# EAGLE schematic mosca (EAGLE 8.3.1)
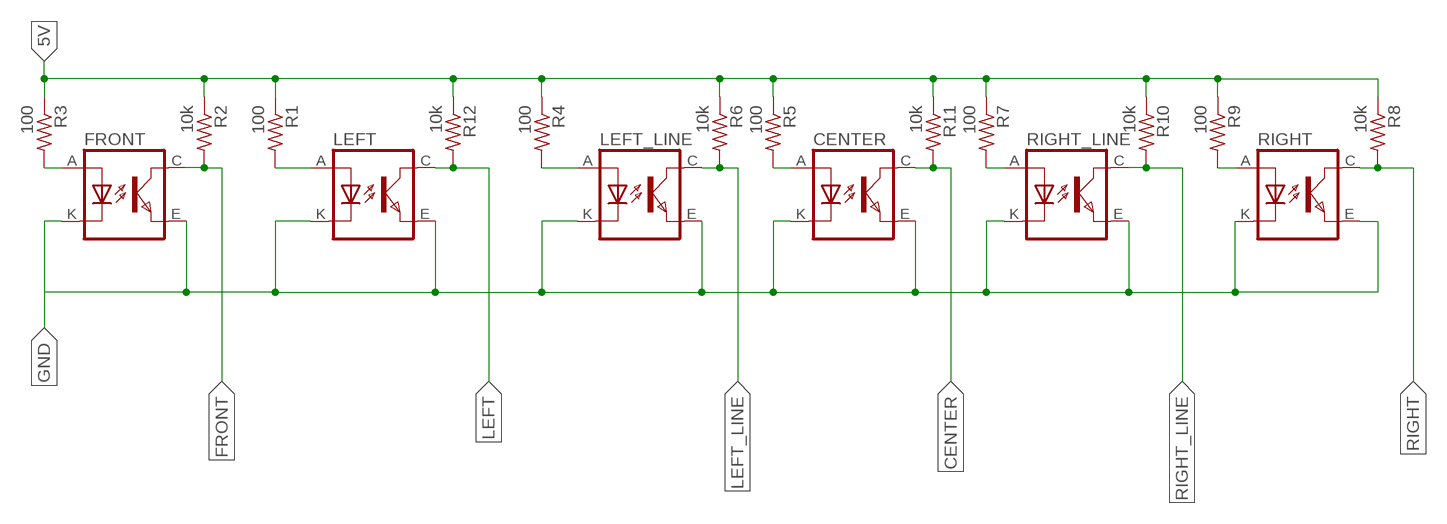
[diagram p0: schematic, sheet 1]

## Parts
CENTER  TCRT5000  [TCRT5000]
FRONT  TCRT5000  [TCRT5000]
LEFT  TCRT5000  [TCRT5000]
LEFT_LINE  TCRT5000  [TCRT5000]
R1  100  R-US_0204/7  [0204/7]
R2  10k  R-US_0204/7  [0204/7]
R3  100  R-US_0204/7  [0204/7]
R4  100  R-US_0204/7  [0204/7]
R5  100  R-US_0204/7  [0204/7]
R6  10k  R-US_0204/7  [0204/7]
R7  100  R-US_0204/7  [0204/7]
R8  10k  R-US_0204/7  [0204/7]
R9  100  R-US_0204/7  [0204/7]
R10  10k  R-US_0204/7  [0204/7]
R11  10k  R-US_0204/7  [0204/7]
R12  10k  R-US_0204/7  [0204/7]
RIGHT  TCRT5000  [TCRT5000]
RIGHT_LINE  TCRT5000  [TCRT5000]

## Nets
5V: R1.1 R2.1 R3.1 R4.1 R5.1 R6.1 R7.1 R8.1 R9.1 R10.1 R11.1 R12.1
CENTER: CENTER.C(COLLECTOR) R11.2
FRONT: FRONT.C(COLLECTOR) R2.2
GND: CENTER.E(EMITTER) CENTER.K(CATHODE) FRONT.E(EMITTER) FRONT.K(CATHODE) LEFT.E(EMITTER) LEFT.K(CATHODE) LEFT_LINE.E(EMITTER) LEFT_LINE.K(CATHODE) RIGHT.E(EMITTER) RIGHT.K(CATHODE) RIGHT_LINE.E(EMITTER) RIGHT_LINE.K(CATHODE)
LEFT: LEFT.C(COLLECTOR) R12.2
LEFT_LINE: LEFT_LINE.C(COLLECTOR) R6.2
N$1: LEFT_LINE.A(ANODE) R4.2
N$2: LEFT.A(ANODE) R1.2
N$3: CENTER.A(ANODE) R5.2
N$4: R7.2 RIGHT_LINE.A(ANODE)
N$5: R9.2 RIGHT.A(ANODE)
N$6: FRONT.A(ANODE) R3.2
RIGHT: R8.2 RIGHT.C(COLLECTOR)
RIGHT_LINE: R10.2 RIGHT_LINE.C(COLLECTOR)

## Library data of the parts
CENTER FRONT LEFT LEFT_LINE RIGHT RIGHT_LINE = tcrt5000:TCRT5000
R1 R11 = rcl:R-US_: RESISTOR, American symbol; 100OHM: 100
R2-R10 R12 = rcl:R-US_: RESISTOR, American symbol